# Altium schematic sheet HP Filter.SchDoc
size A4; SheetNumber: 3; SheetTotal: 7
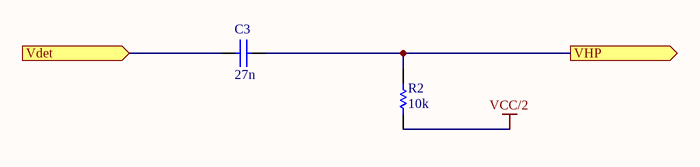
[diagram p0: HP Filter.SchDoc]

## Parts
C3  27n  [ece-RAD0.2]
R2  10k  [ece-AXIAL0.4]

## Ports
Vdet (in), VHP (out)

## Nets
VCC/2: R2.1
Vdet: C3.1 ; port Vdet
VHP: C3.2 R2.2 ; port VHP

## Library data of the parts
C3 = CAP: Capacitor Non Polarised Through Hole; Value: 27n
R2 = Res1: Resistor; Published: 8-Jun-2000; LatestRevisionDate: 17-Jul-2002; LatestRevisionNote: Re-released for DXP Platform.; PackageReference: AXIAL-0.3; Publisher: Altium Limited; Value: 10k